# EAGLE schematic universal_bc (EAGLE 9.6.2)
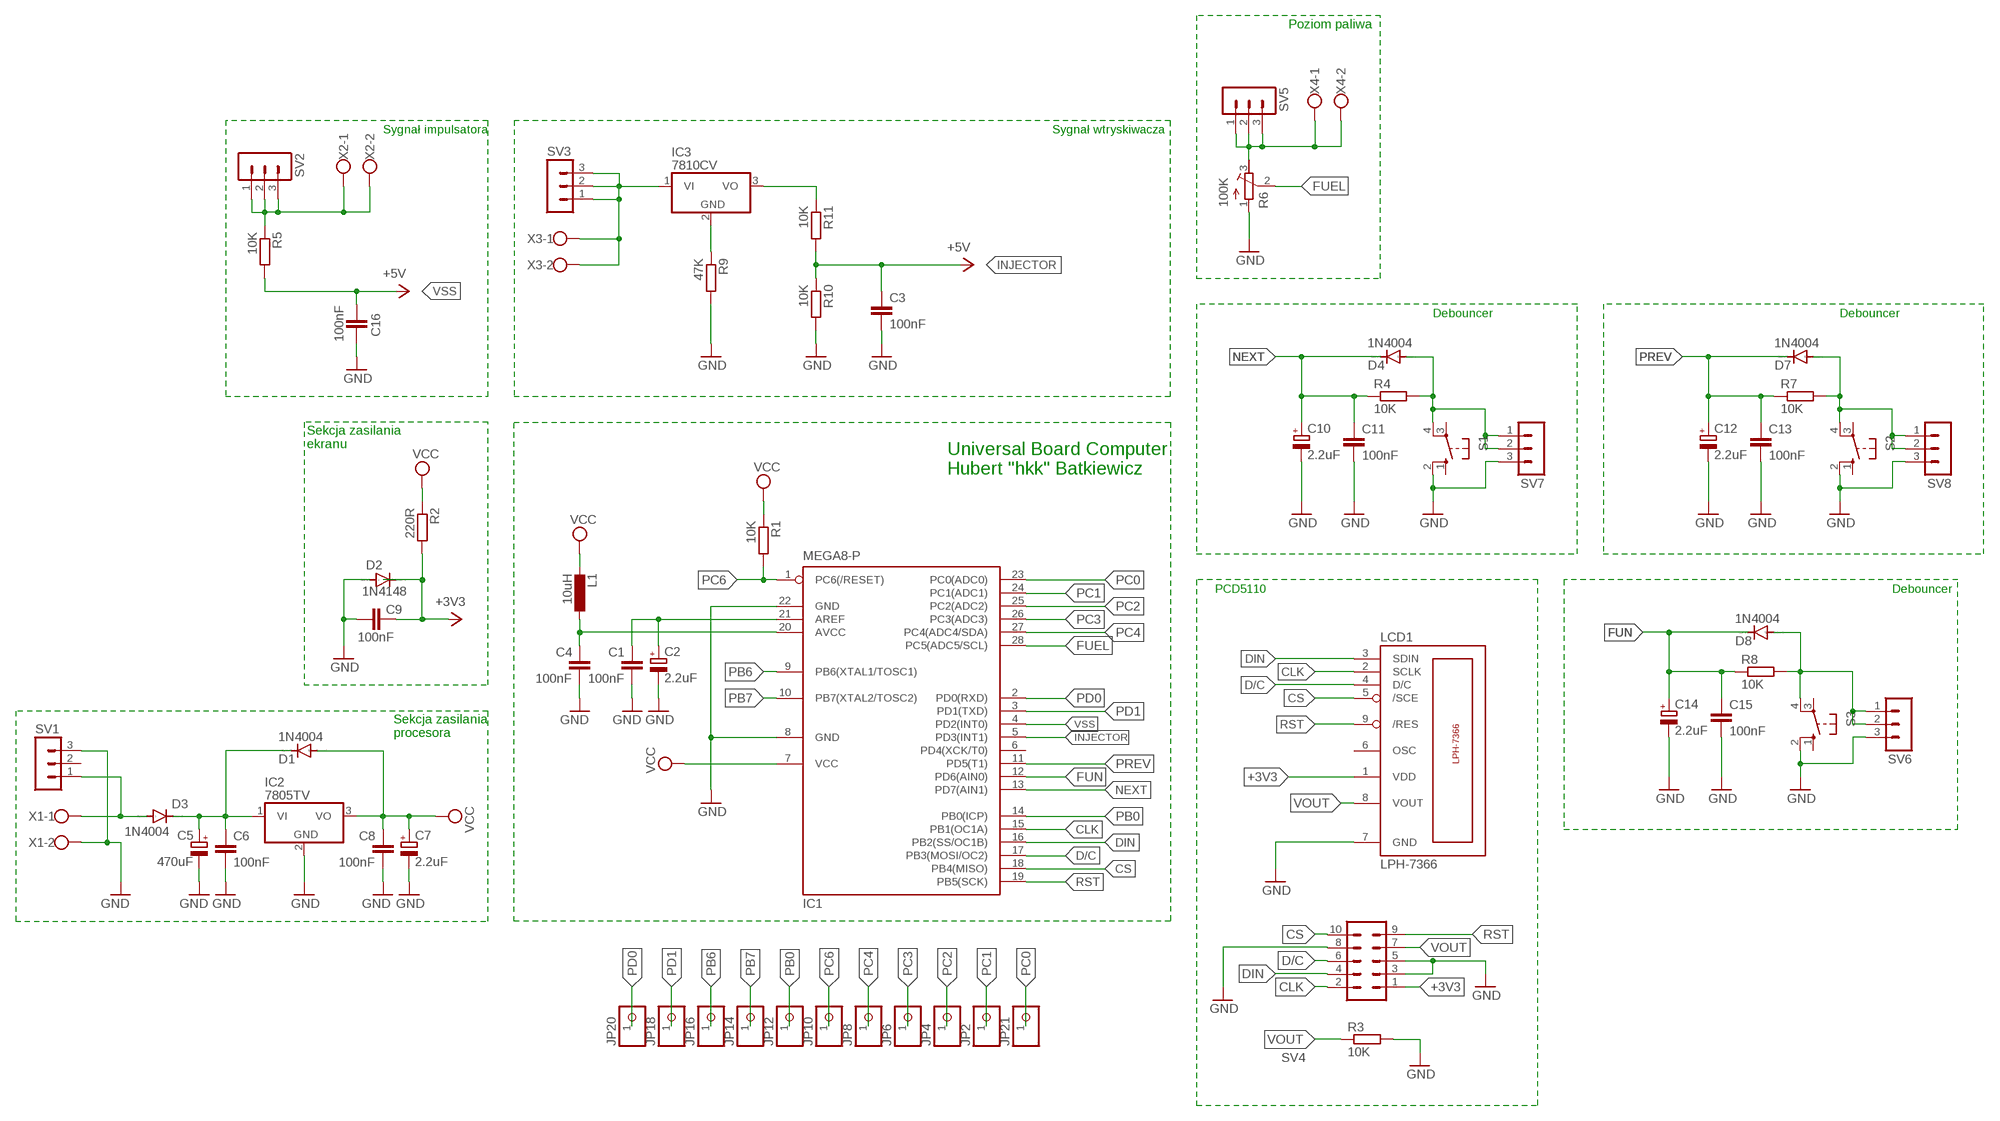
[diagram p0: schematic, sheet 1]

## Parts
C1  100nF  C-EU025-025X050  [C025-025X050]
C2  2.2uF  CPOL-EUE2,5-6E  [E2,5-6E]
C3  100nF  C-EU025-025X050  [C025-025X050]
C4  100nF  C-EU025-025X050  [C025-025X050]
C5  470uF  CPOL-EUE2,5-6E  [E2,5-6E]
C6  100nF  C-EU025-025X050  [C025-025X050]
C7  2.2uF  CPOL-EUE2,5-6E  [E2,5-6E]
C8  100nF  C-EU025-025X050  [C025-025X050]
C9  100nF  C-EU025-025X050  [C025-025X050]
C10  2.2uF  CPOL-EUE2,5-6E  [E2,5-6E]
C11  100nF  C-EU025-025X050  [C025-025X050]
C12  2.2uF  CPOL-EUE2,5-6E  [E2,5-6E]
C13  100nF  C-EU025-025X050  [C025-025X050]
C14  2.2uF  CPOL-EUE2,5-6E  [E2,5-6E]
C15  100nF  C-EU025-025X050  [C025-025X050]
C16  100nF  C-EU025-025X050  [C025-025X050]
D1  1N4004  [DO41-10]
D2  1N4148  1N4148DO35-7  [DO35-7]
D3  1N4004  [DO41-10]
D4  1N4004  [DO41-10]
D7  1N4004  [DO41-10]
D8  1N4004  [DO41-10]
IC1  MEGA8-P  [DIL28-3]
IC2  7805TV  [TO220V]
IC3  7810CV  7805TV  [TO220V]
JP2  PINHD-1X1  [1X01]
JP4  PINHD-1X1  [1X01]
JP6  PINHD-1X1  [1X01]
JP8  PINHD-1X1  [1X01]
JP10  PINHD-1X1  [1X01]
JP12  PINHD-1X1  [1X01]
JP14  PINHD-1X1  [1X01]
JP16  PINHD-1X1  [1X01]
JP18  PINHD-1X1  [1X01]
JP20  PINHD-1X1  [1X01]
JP21  PINHD-1X1  [1X01]
L1  10uH  L-EU0207/2V  [0207/2V]
LCD1  LPH-7366  [LPH-7366]
R1  10K  R-EU_0207/10  [0207/10]
R2  220R  R-EU_0207/10  [0207/10]
R3  10K  R-EU_0207/10  [0207/10]
R4  10K  R-EU_0207/10  [0207/10]
R5  10K  R-EU_0207/10  [0207/10]
R6  100K  R-TRIMM3339P  [RTRIM3339P]
R7  10K  R-EU_0207/10  [0207/10]
R8  10K  R-EU_0207/10  [0207/10]
R9  47K  R-EU_0207/10  [0207/10]
R10  10K  R-EU_0207/10  [0207/10]
R11  10K  R-EU_0207/10  [0207/10]
S1  10-XX  [B3F-10XX]
S2  10-XX  [B3F-10XX]
S3  10-XX  [B3F-10XX]
SV1  MA03-1  [MA03-1]
SV2  MA03-1  [MA03-1]
SV3  MA03-1  [MA03-1]
SV4  MA05-2  [MA05-2]
SV5  MA03-1  [MA03-1]
SV6  MA03-1  [MA03-1]
SV7  MA03-1  [MA03-1]
SV8  MA03-1  [MA03-1]
X1  W237-102  [W237-102]
X2  W237-102  [W237-102]
X3  W237-102  [W237-102]
X4  W237-102  [W237-102]

## Nets
+3V3: C9.1 D2.C LCD1.1(VDD) R2.2 SV4.1
CLK: IC1.15(PB1(OC1A)) LCD1.2(SCLK) SV4.2
CS: IC1.18(PB4(MISO)) LCD1.5(/SCE) SV4.10
D/C: IC1.17(PB3(MOSI/OC2)) LCD1.4(D/C) SV4.6
DIN: IC1.16(PB2(SS/OC1B)) LCD1.3(SDIN) SV4.4
FLOAT: R6.3(E) SV5.1 SV5.2 SV5.3 X4.1 X4.2
FUEL: IC1.28(PC5(ADC5/SCL)) R6.2(S)
FUN: C14.+ C15.1 D8.C IC1.12(PD6(AIN0)) R8.1
GND: C1.2 C2.- C3.2 C4.2 C5.- C6.2 C7.- C8.2 C9.2 C10.- C11.2 C12.- C13.2 C14.- C15.2 C16.1 D2.A IC1.8(GND) IC1.22(GND) IC2.2(GND) LCD1.7(GND) R3.2 R6.1(A) R9.2 R10.2 S1.2(S1) S2.2(S1) S3.2(S1) SV1.3 SV4.3 SV4.5 SV4.8 SV6.3 SV7.3 SV8.3 X1.2
INJECTOR: C3.1 IC1.5(PD3(INT1)) R10.1 R11.2 ; supply symbol labelled +5V
N$2: C1.1 C2.+ IC1.21(AREF)
N$3: C4.1 IC1.20(AVCC) L1.1
N$4: C5.+ C6.1 D1.C D3.C IC2.1(VI)
N$7: IC3.1(VI) SV3.1 SV3.2 SV3.3 X3.1 X3.2
N$10: D4.A R4.2 S1.4(P1) SV7.1 SV7.2
N$14: D7.A R7.2 S2.4(P1) SV8.1 SV8.2
N$16: D8.A R8.2 S3.4(P1) SV6.1 SV6.2
N$19: D3.A SV1.1 X1.1
N$20: R5.1 SV2.1 SV2.2 SV2.3 X2.1 X2.2
N$21: IC3.2(GND) R9.1
N$22: IC3.3(VO) R11.1
NEXT: C10.+ C11.1 D4.C IC1.13(PD7(AIN1)) R4.1
PB0: IC1.14(PB0(ICP)) JP12.1
PB6: IC1.9(PB6(XTAL1/TOSC1)) JP16.1
PB7: IC1.10(PB7(XTAL2/TOSC2)) JP14.1
PC0: IC1.23(PC0(ADC0)) JP21.1
PC1: IC1.24(PC1(ADC1)) JP2.1
PC2: IC1.25(PC2(ADC2)) JP4.1
PC3: IC1.26(PC3(ADC3)) JP6.1
PC4: IC1.27(PC4(ADC4/SDA)) JP8.1
PC6: IC1.1(PC6(/RESET)) JP10.1 R1.2
PD0: IC1.2(PD0(RXD)) JP20.1
PD1: IC1.3(PD1(TXD)) JP18.1
PREV: C12.+ C13.1 D7.C IC1.11(PD5(T1)) R7.1
RST: IC1.19(PB5(SCK)) LCD1.9(/RES) SV4.9
VCC: C7.+ C8.1 D1.A IC1.7(VCC) IC2.3(VO) L1.2 R1.1 R2.1
VOUT: LCD1.8(VOUT) R3.1 SV4.7
VSS: C16.2 IC1.4(PD2(INT0)) R5.2 ; supply symbol labelled +5V
Unconnected: IC1.6(PD4(XCK/T0)) LCD1.6(OSC) S1.1(S) S1.3(P) S2.1(S) S2.3(P) S3.1(S) S3.3(P) SV1.2

## Notes on the sheet
- Poziom paliwa
- Sygnał impulsatora | Sygnał wtryskiwacza
- Debouncer | Debouncer
- Sekcja zasilania
  ekranu
- Universal Board Computer
  Hubert "hkk" Batkiewicz
- PCD5110 | Debouncer
- Sekcja zasilania
  procesora

## Library data of the parts
C1 C3 C4 C6 C8 C9 C11 C13 C15 C16 = rcl:C-EU: CAPACITOR, European symbol; SPICEPREFIX: C
C2 C5 C7 C10 C12 C14 = rcl:CPOL-EU: POLARIZED CAPACITOR, European symbol; SPICEPREFIX: C
D1 D3 D4 D7 D8 = diode:1N4004: DIODE general purpose rectifier, 1 A
D2 = diode:1N4148: DIODE high speed (Philips)
IC1 = atmel:MEGA8-P: MICROCONTROLLER 8 Kbytes FLASH, 1 kbytes SRAM, 512 bytes EEPROM, USART, 4-channel 10 bit ADC, 2-channel 8 bit ADC Pin compatible with Atmega48, ATMega88, ATMega168 Source: avr.lbr; OC_FARNELL: unknown; OC_NEWARK: unknown
IC2 IC3 = linear:78*: Positive VOLTAGE REGULATOR Source: http://cache.national.com/ds/LM/LM78L05.pdf http://www.fairchildsemi.com/ds/LM/LM7805.pdf
JP2 JP4 JP6 JP8 JP10 JP12 JP14 JP16 JP18 JP20 JP21 = pinhead:PINHD-1X1: PIN HEADER
L1 = rcl:L-EU: INDUCTOR, European symbol; SPICEPREFIX: L
LCD1 = lph-7366:LPH-7366
R1-R5 R7-R11 = rcl:R-EU_: RESISTOR, European symbol; SPICEPREFIX: R
R6 = rcl:R-TRIMM: Trimm resistor; SPICEMODEL: X; SPICEPREFIXL: POT
S1-S3 = switch-omron:10-XX: OMRON SWITCH; MPN: B3F-1000; OC_FARNELL: 176432; OC_NEWARK: 36M3542
SV1-SV3 SV5-SV8 = con-lstb:MA03-1: PIN HEADER; OC_FARNELL: unknown; OC_NEWARK: unknown
SV4 = con-lstb:MA05-2: PIN HEADER; OC_FARNELL: unknown; OC_NEWARK: unknown
X1-X4 = con-wago-500:W237-102: WAGO SCREW CLAMP; MPN: 237-102; OC_FARNELL: unknown; OC_NEWARK: 70K9898